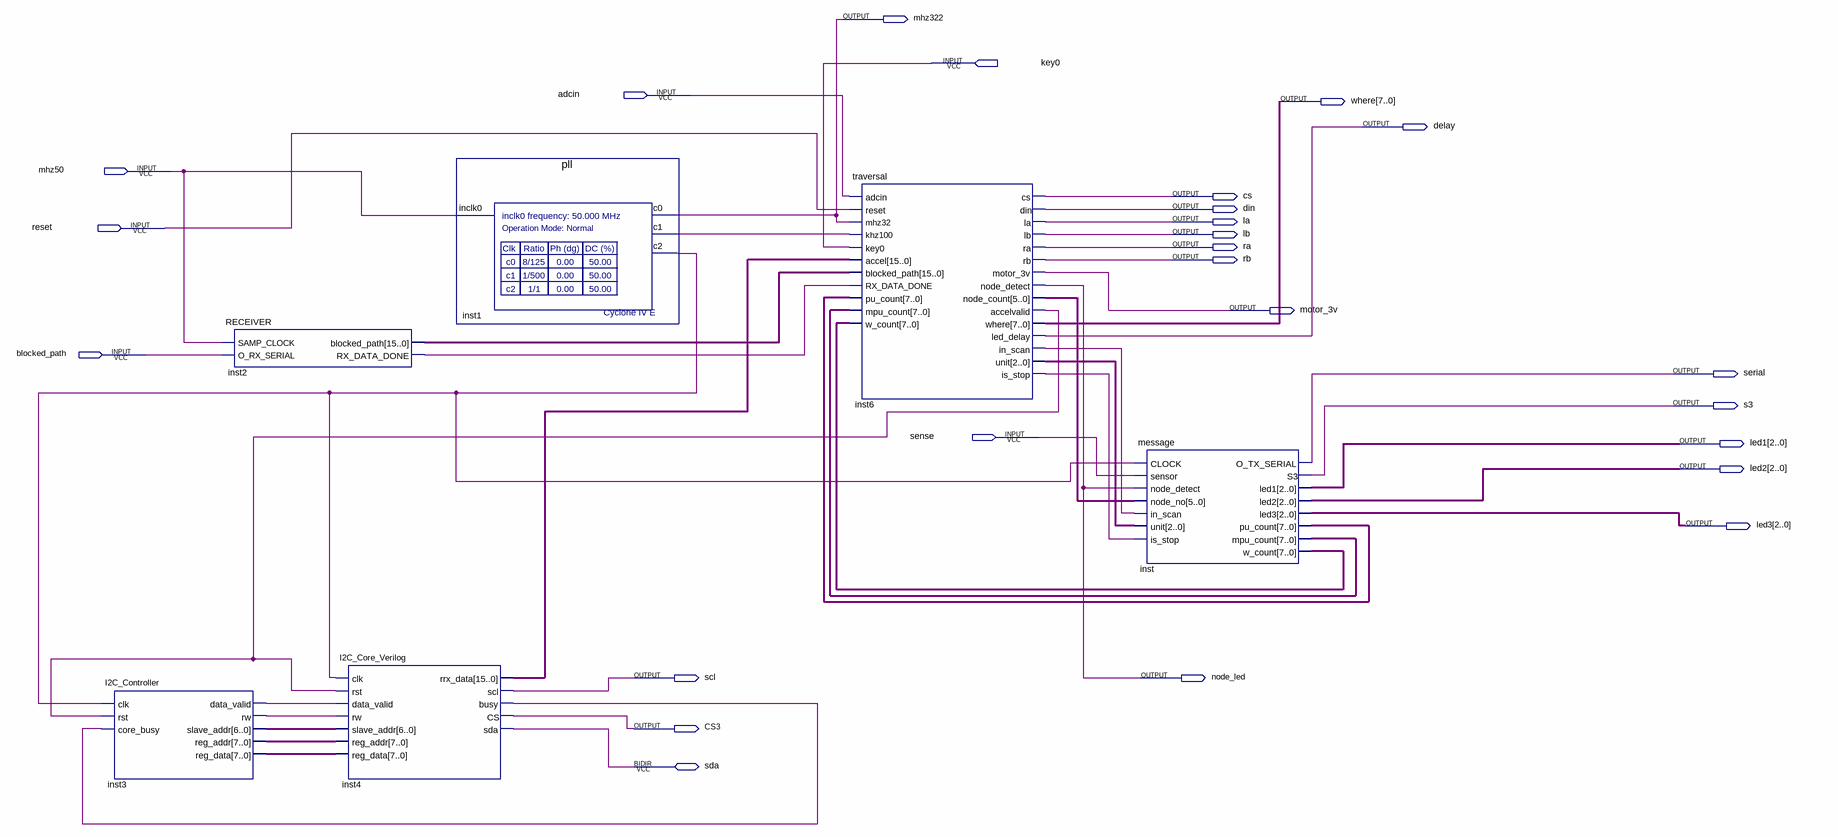
[diagram p0: schematic sheet]
// Quartus schematic bot.bdf as structural Verilog: 6 symbols, 25 pins
module bot (
  input  key0,
  input  adcin,
  input  mhz50,
  input  reset,
  input  blocked_path,
  input  sense,
  inout  sda,
  output mhz322,
  output [7:0] where,
  output delay,
  output cs,
  output din,
  output la,
  output lb,
  output ra,
  output rb,
  output motor_3v,
  output serial,
  output s3,
  output [2:0] led1,
  output [2:0] led2,
  output [2:0] led3,
  output scl,
  output node_led,
  output CS3
);

  wire inst1_c1, inst1_c2, inst2_rx_data_done, inst3_data_valid, inst3_rw, inst4_busy, inst6_accelvalid,
       inst6_in_scan, inst6_is_stop;
  wire [2:0] inst6_unit;
  wire [5:0] inst6_node_count;
  wire [6:0] inst3_slave_addr;
  wire [7:0] inst3_reg_addr, inst3_reg_data, inst_mpu_count, inst_pu_count, inst_w_count;
  wire [15:0] inst2_blocked_path, inst4_rrx_data;

  I2C_Controller inst3 (
    .clk(inst1_c2), .rst(inst6_accelvalid), .core_busy(inst4_busy), .data_valid(inst3_data_valid),
    .rw(inst3_rw), .slave_addr(inst3_slave_addr), .reg_addr(inst3_reg_addr), .reg_data(inst3_reg_data));
  RECEIVER inst2 (
    .SAMP_CLOCK(mhz50), .O_RX_SERIAL(blocked_path), .blocked_path(inst2_blocked_path),
    .RX_DATA_DONE(inst2_rx_data_done));
  I2C_Core_Verilog inst4 (
    .clk(inst1_c2), .rst(inst6_accelvalid), .data_valid(inst3_data_valid), .rw(inst3_rw),
    .slave_addr(inst3_slave_addr), .reg_addr(inst3_reg_addr), .reg_data(inst3_reg_data),
    .rrx_data(inst4_rrx_data), .scl(scl), .busy(inst4_busy), .CS(CS3), .sda(sda));
  pll inst1 (.inclk0(mhz50), .c0(mhz322), .c1(inst1_c1), .c2(inst1_c2));
  traversal inst6 (
    .adcin(adcin), .reset(reset), .mhz32(mhz322), .khz100(inst1_c1), .key0(key0), .accel(inst4_rrx_data),
    .blocked_path(inst2_blocked_path), .RX_DATA_DONE(inst2_rx_data_done), .pu_count(inst_pu_count),
    .mpu_count(inst_mpu_count), .w_count(inst_w_count), .cs(cs), .din(din), .la(la), .lb(lb), .ra(ra),
    .rb(rb), .motor_3v(motor_3v), .node_detect(node_led), .node_count(inst6_node_count),
    .accelvalid(inst6_accelvalid), .where(where), .led_delay(delay), .in_scan(inst6_in_scan),
    .unit(inst6_unit), .is_stop(inst6_is_stop));
  message inst (
    .CLOCK(inst1_c2), .sensor(sense), .node_detect(node_led), .node_no(inst6_node_count),
    .in_scan(inst6_in_scan), .unit(inst6_unit), .is_stop(inst6_is_stop), .O_TX_SERIAL(serial), .S3(s3),
    .led1(led1), .led2(led2), .led3(led3), .pu_count(inst_pu_count), .mpu_count(inst_mpu_count),
    .w_count(inst_w_count));
endmodule
